# EasyEDA schematic SCH_QuestDeck_2025-08-01.json
TITLE: Sheet_1; REV: 1.0; Date: 2025-04-13; Sheet: 1/1; Drawn By: esemv; Company: Your Company
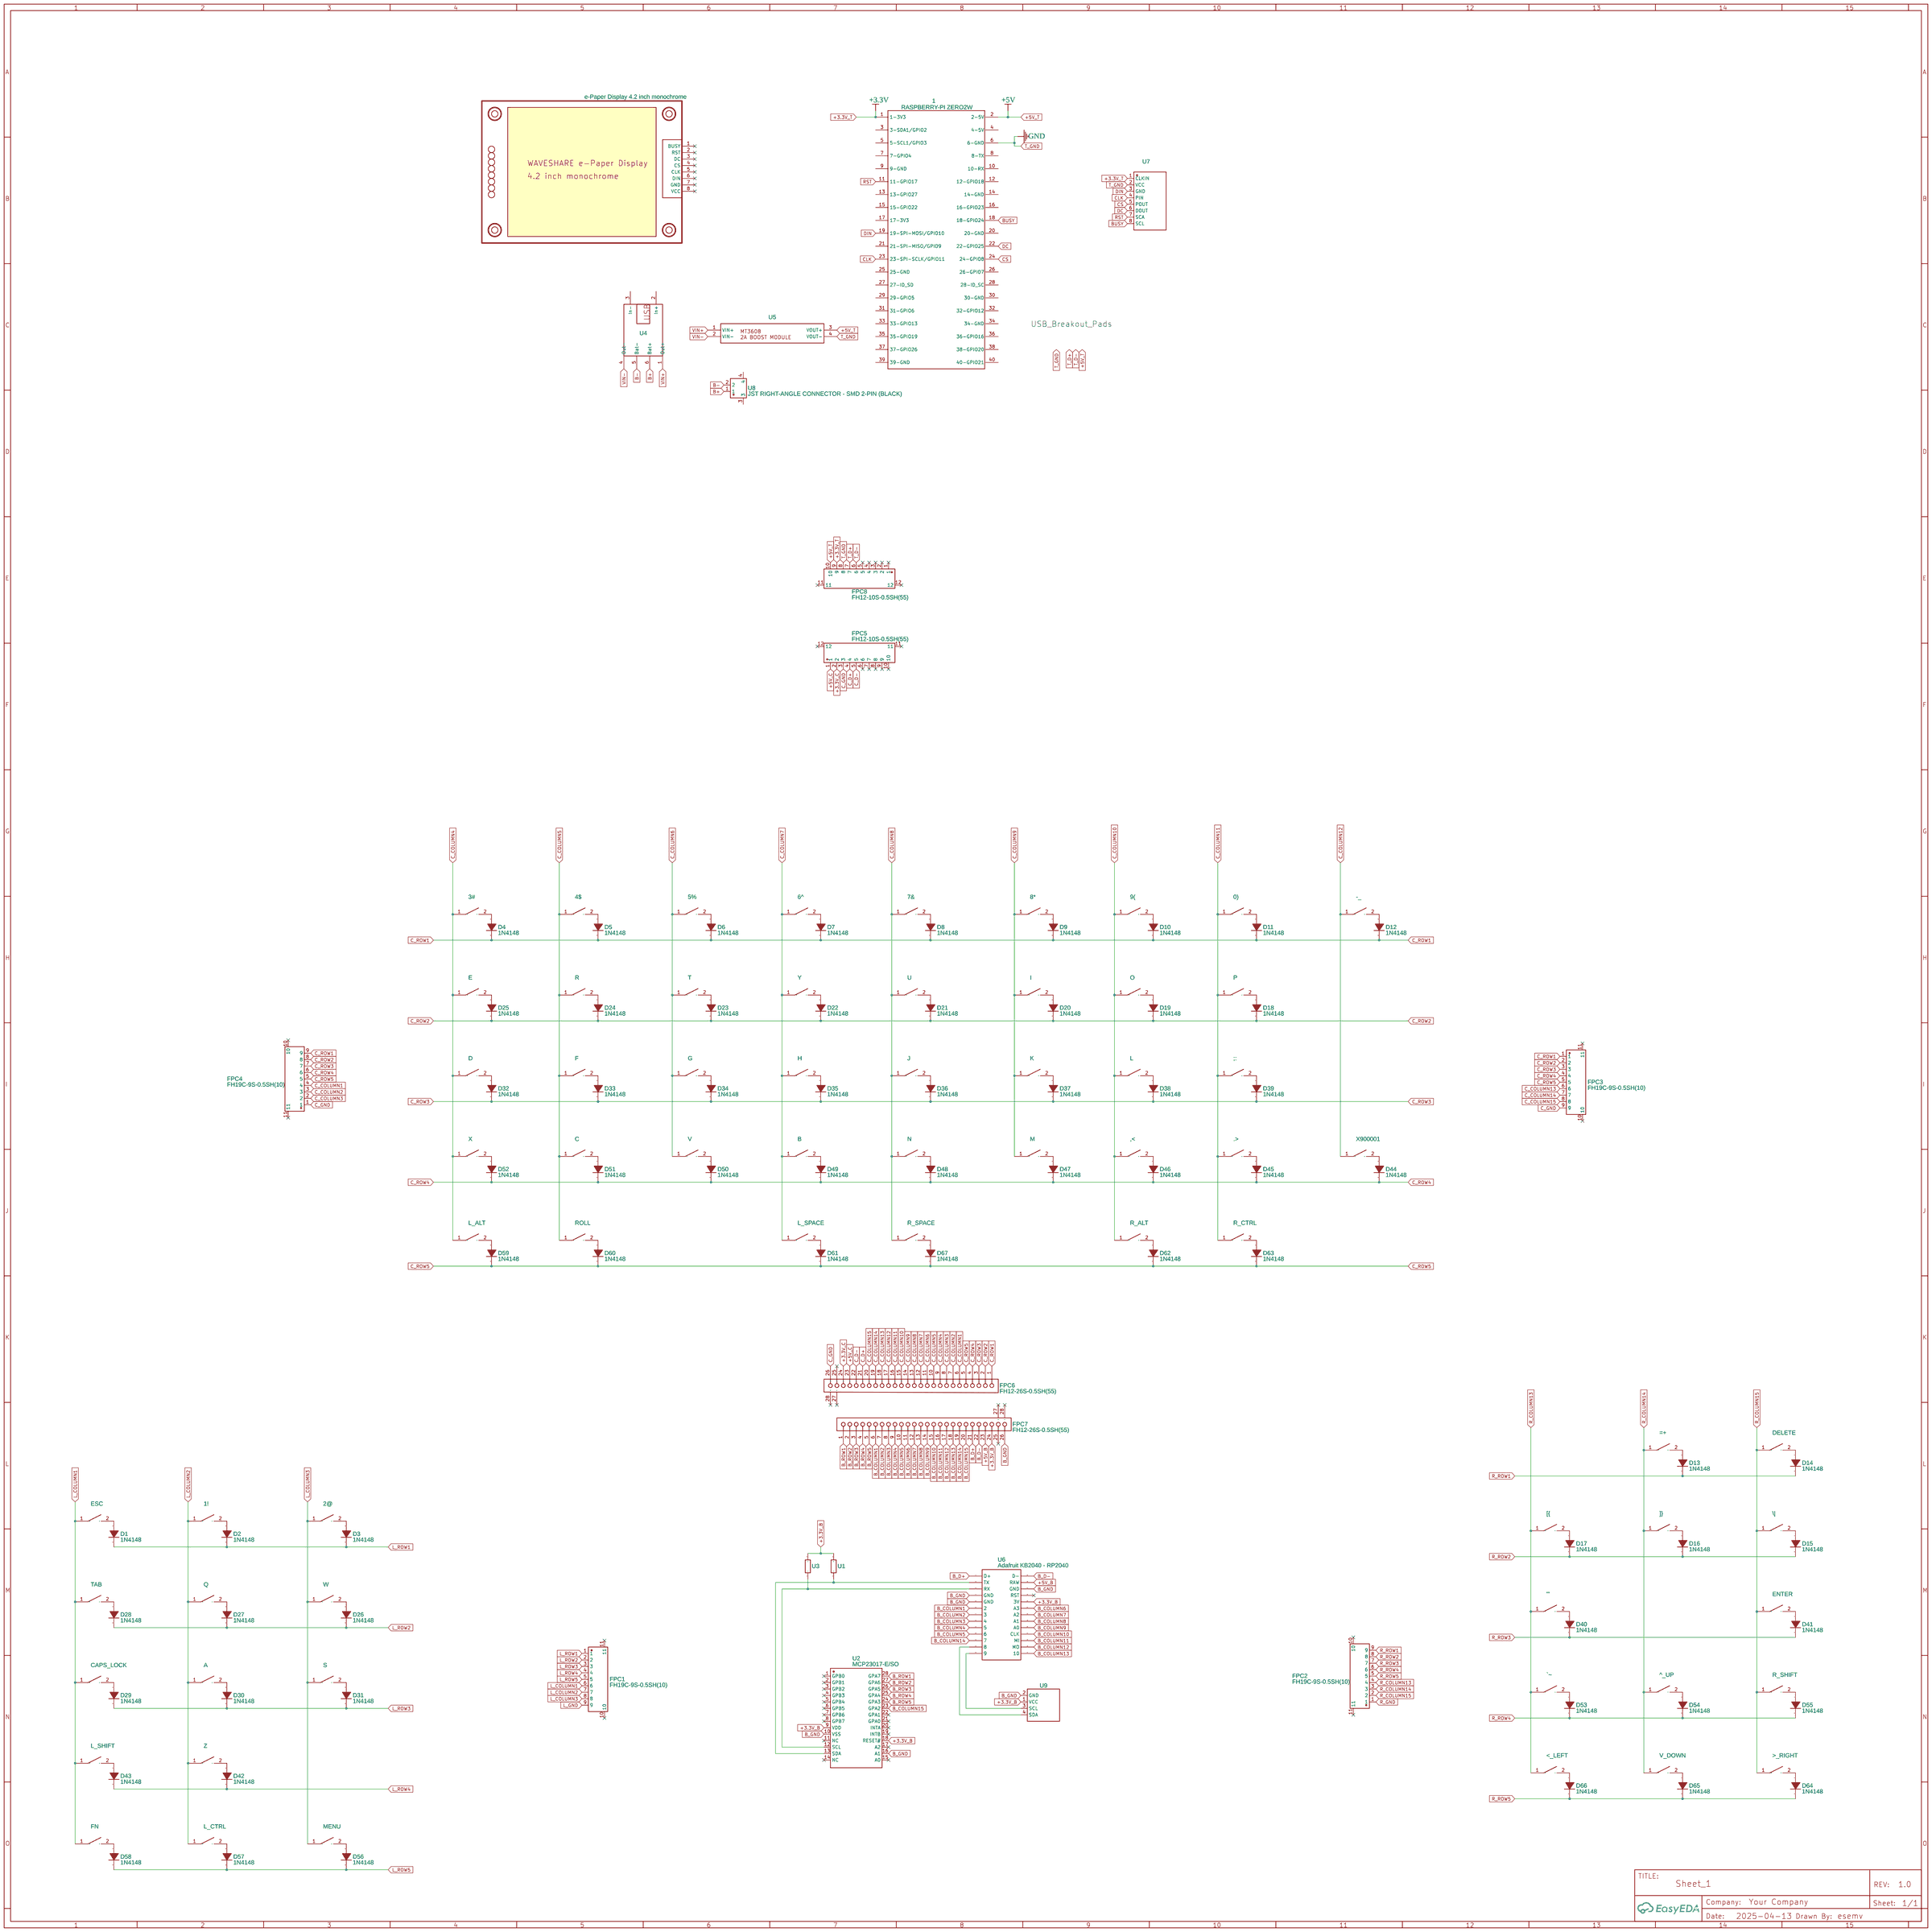
[diagram p0: schematic sheet]

## Parts
0)  NO  [KAILH-SWITCH]
1  RASPBERRY-PI ZERO2W  [RASPBERRY_PI_ZERO_SMD]
1!  NO  [KAILH-SWITCH]
2@  NO  [KAILH-SWITCH]
3#  NO  [KAILH-SWITCH]
4$  NO  [KAILH-SWITCH]
5%  NO  [KAILH-SWITCH]
6&#94;  NO  [KAILH-SWITCH]
6^  NO
7&  NO  [KAILH-SWITCH]
8*  NO  [KAILH-SWITCH]
9(  NO  [KAILH-SWITCH]
&#94;_UP  NO  [KAILH-SWITCH]
&#96;&#126;  NO  [KAILH-SWITCH]
'"  NO  [KAILH-SWITCH]
,<  NO  [KAILH-SWITCH]
-_  NO  [KAILH-SWITCH]
.>  NO  [KAILH-SWITCH]
/?#1  NO
;:  NO  [KAILH-SWITCH]
<_LEFT  NO  [KAILH-SWITCH]
=+  NO  [KAILH-SWITCH]
>_RIGHT  NO  [KAILH-SWITCH]
[{  NO  [KAILH-SWITCH]
\|  NO  [KAILH-SWITCH]
]}  NO  [KAILH-SWITCH]
^_UP  NO
`~  NO
A  NO  [KAILH-SWITCH]
B  NO  [KAILH-SWITCH]
C  NO  [KAILH-SWITCH]
CAPS_LOCK  NO  [KAILH-SWITCH]
D  NO  [KAILH-SWITCH]
D1  1N4148  [DO-35_BD2.0-L4.0-P8.00-D0.5-FD]
D2  1N4148  [DO-35_BD2.0-L4.0-P8.00-D0.5-FD]
D3  1N4148  [DO-35_BD2.0-L4.0-P8.00-D0.5-FD]
D4  1N4148  [DO-35_BD2.0-L4.0-P8.00-D0.5-FD]
D5  1N4148  [DO-35_BD2.0-L4.0-P8.00-D0.5-FD]
D6  1N4148  [DO-35_BD2.0-L4.0-P8.00-D0.5-FD]
D7  1N4148  [DO-35_BD2.0-L4.0-P8.00-D0.5-FD]
D8  1N4148  [DO-35_BD2.0-L4.0-P8.00-D0.5-FD]
D9  1N4148  [DO-35_BD2.0-L4.0-P8.00-D0.5-FD]
D10  1N4148  [DO-35_BD2.0-L4.0-P8.00-D0.5-FD]
D11  1N4148  [DO-35_BD2.0-L4.0-P8.00-D0.5-FD]
D12  1N4148  [DO-35_BD2.0-L4.0-P8.00-D0.5-FD]
D13  1N4148  [DO-35_BD2.0-L4.0-P8.00-D0.5-FD]
D14  1N4148  [DO-35_BD2.0-L4.0-P8.00-D0.5-FD]
D15  1N4148  [DO-35_BD2.0-L4.0-P8.00-D0.5-FD]
D16  1N4148  [DO-35_BD2.0-L4.0-P8.00-D0.5-FD]
D17  1N4148  [DO-35_BD2.0-L4.0-P8.00-D0.5-FD]
D18  1N4148  [DO-35_BD2.0-L4.0-P8.00-D0.5-FD]
D19  1N4148  [DO-35_BD2.0-L4.0-P8.00-D0.5-FD]
D20  1N4148  [DO-35_BD2.0-L4.0-P8.00-D0.5-FD]
D21  1N4148  [DO-35_BD2.0-L4.0-P8.00-D0.5-FD]
D22  1N4148  [DO-35_BD2.0-L4.0-P8.00-D0.5-FD]
D23  1N4148  [DO-35_BD2.0-L4.0-P8.00-D0.5-FD]
D24  1N4148  [DO-35_BD2.0-L4.0-P8.00-D0.5-FD]
D25  1N4148  [DO-35_BD2.0-L4.0-P8.00-D0.5-FD]
D26  1N4148  [DO-35_BD2.0-L4.0-P8.00-D0.5-FD]
D27  1N4148  [DO-35_BD2.0-L4.0-P8.00-D0.5-FD]
D28  1N4148  [DO-35_BD2.0-L4.0-P8.00-D0.5-FD]
D29  1N4148  [DO-35_BD2.0-L4.0-P8.00-D0.5-FD]
D30  1N4148  [DO-35_BD2.0-L4.0-P8.00-D0.5-FD]
D31  1N4148  [DO-35_BD2.0-L4.0-P8.00-D0.5-FD]
D32  1N4148  [DO-35_BD2.0-L4.0-P8.00-D0.5-FD]
D33  1N4148  [DO-35_BD2.0-L4.0-P8.00-D0.5-FD]
D34  1N4148  [DO-35_BD2.0-L4.0-P8.00-D0.5-FD]
D35  1N4148  [DO-35_BD2.0-L4.0-P8.00-D0.5-FD]
D36  1N4148  [DO-35_BD2.0-L4.0-P8.00-D0.5-FD]
D37  1N4148  [DO-35_BD2.0-L4.0-P8.00-D0.5-FD]
D38  1N4148  [DO-35_BD2.0-L4.0-P8.00-D0.5-FD]
D39  1N4148  [DO-35_BD2.0-L4.0-P8.00-D0.5-FD]
D40  1N4148  [DO-35_BD2.0-L4.0-P8.00-D0.5-FD]
D41  1N4148  [DO-35_BD2.0-L4.0-P8.00-D0.5-FD]
D42  1N4148  [DO-35_BD2.0-L4.0-P8.00-D0.5-FD]
D43  1N4148  [DO-35_BD2.0-L4.0-P8.00-D0.5-FD]
D44  1N4148  [DO-35_BD2.0-L4.0-P8.00-D0.5-FD]
D45  1N4148  [DO-35_BD2.0-L4.0-P8.00-D0.5-FD]
D46  1N4148  [DO-35_BD2.0-L4.0-P8.00-D0.5-FD]
D47  1N4148  [DO-35_BD2.0-L4.0-P8.00-D0.5-FD]
D48  1N4148  [DO-35_BD2.0-L4.0-P8.00-D0.5-FD]
D49  1N4148  [DO-35_BD2.0-L4.0-P8.00-D0.5-FD]
D50  1N4148  [DO-35_BD2.0-L4.0-P8.00-D0.5-FD]
D51  1N4148  [DO-35_BD2.0-L4.0-P8.00-D0.5-FD]
D52  1N4148  [DO-35_BD2.0-L4.0-P8.00-D0.5-FD]
D53  1N4148  [DO-35_BD2.0-L4.0-P8.00-D0.5-FD]
D54  1N4148  [DO-35_BD2.0-L4.0-P8.00-D0.5-FD]
D55  1N4148  [DO-35_BD2.0-L4.0-P8.00-D0.5-FD]
D56  1N4148  [DO-35_BD2.0-L4.0-P8.00-D0.5-FD]
D57  1N4148  [DO-35_BD2.0-L4.0-P8.00-D0.5-FD]
D58  1N4148  [DO-35_BD2.0-L4.0-P8.00-D0.5-FD]
D59  1N4148  [DO-35_BD2.0-L4.0-P8.00-D0.5-FD]
D60  1N4148  [DO-35_BD2.0-L4.0-P8.00-D0.5-FD]
D61  1N4148  [DO-35_BD2.0-L4.0-P8.00-D0.5-FD]
D62  1N4148  [DO-35_BD2.0-L4.0-P8.00-D0.5-FD]
D63  1N4148  [DO-35_BD2.0-L4.0-P8.00-D0.5-FD]
D64  1N4148  [DO-35_BD2.0-L4.0-P8.00-D0.5-FD]
D65  1N4148  [DO-35_BD2.0-L4.0-P8.00-D0.5-FD]
D66  1N4148  [DO-35_BD2.0-L4.0-P8.00-D0.5-FD]
D67  1N4148  [DO-35_BD2.0-L4.0-P8.00-D0.5-FD]
DELETE  NO  [KAILH-SWITCH]
E  NO  [KAILH-SWITCH]
ENTER  NO  [KAILH-SWITCH]
ESC  NO  [KAILH-SWITCH]
F  NO  [KAILH-SWITCH]
FN  NO  [KAILH-SWITCH]
FPC1  FH19C-9S-0.5SH(10)  [FPC-SMD_9P-P0.50_FH19C-9S-0.5SH-10]
FPC2  FH19C-9S-0.5SH(10)  [FPC-SMD_9P-P0.50_FH19C-9S-0.5SH-10]
FPC3  FH19C-9S-0.5SH(10)  [FPC-SMD_9P-P0.50_FH19C-9S-0.5SH-10]
FPC4  FH19C-9S-0.5SH(10)  [FPC-SMD_9P-P0.50_FH19C-9S-0.5SH-10]
FPC5  FH12-10S-0.5SH(55)  [FPC-SMD_FH12-10S-0.5SH-55]
FPC6  FH12-26S-0.5SH(55)  [FPC-SMD_FH12-26S-0.5SH-55]
FPC7  FH12-26S-0.5SH(55)  [FPC-SMD_FH12-26S-0.5SH-55]
FPC8  FH12-10S-0.5SH(55)  [FPC-SMD_FH12-10S-0.5SH-55]
G  NO  [KAILH-SWITCH]
H  NO  [KAILH-SWITCH]
I  NO  [KAILH-SWITCH]
J  NO  [KAILH-SWITCH]
K  NO  [KAILH-SWITCH]
L  NO  [KAILH-SWITCH]
L_ALT  NO  [SW_KAILH_CHOC_V1_1.25U]
L_CTRL  NO  [KAILH-SWITCH]
L_SHIFT  NO  [KAILH-SWITCH]
L_SPACE  NO  [KAILH-SWITCH]
M  NO  [KAILH-SWITCH]
MENU  NO  [KAILH-SWITCH]
N  NO  [KAILH-SWITCH]
NO  e-Paper Display 4.2 inch monochrome  [EPAPER DISPLAY 4.2INCH WAVESHARE]
O  NO  [KAILH-SWITCH]
P  NO  [KAILH-SWITCH]
Q  NO  [KAILH-SWITCH]
R  NO  [KAILH-SWITCH]
R_ALT  NO  [KAILH-SWITCH]
R_CTRL  NO  [SW_KAILH_CHOC_V1_1.25U]
R_SHIFT  NO  [KAILH-SWITCH]
R_SPACE  NO  [KAILH-SWITCH]
ROLL  NO  [KAILH-SWITCH]
S  NO  [KAILH-SWITCH]
T  NO  [KAILH-SWITCH]
TAB  NO  [KAILH-SWITCH]
U  NO  [KAILH-SWITCH]
U1  NO  [AXIAL-0.4]
U2  MCP23017-E/SO  [SOIC-28_L18.0-W7.5-P1.27-LS10.3-BL]
U3  NO  [AXIAL-0.4]
U4  NO  [TP4056_SMD]
U5  NO  [MT3608]
U6  Adafruit KB2040 - RP2040  [ADAFRUIT KB2040 - RP2040]
U7  NO  [8 PIN]
U8  JST RIGHT-ANGLE CONNECTOR - SMD 2-PIN (BLACK)  [CONN-SMD_JST-PH-2-SMT-RA]
U9  NO  [OLED DISPLAY 128X32 0.91" I2C SSD1306]
V  NO  [KAILH-SWITCH]
V_DOWN  NO  [KAILH-SWITCH]
W  NO  [KAILH-SWITCH]
X  NO  [KAILH-SWITCH]
Y  NO  [KAILH-SWITCH]
Z  NO  [KAILH-SWITCH]

## Library data of the parts
0) 1! 2@ 3# 4$ 5% 6&#94; 7& 8* 9( &#94;_UP &#96;&#126; '" ,< -_ .> ;: <_LEFT =+ >_RIGHT [{ \| ]} A B C CAPS_LOCK D DELETE E ENTER ESC F FN G H I J K L L_ALT L_CTRL L_SHIFT L_SPACE M MENU N O P Q R R_ALT R_CTRL R_SHIFT R_SPACE ROLL S T TAB U V V_DOWN W X Y Z = kailh choc switch v1: Contributor: bplusplus
1 = RASPBERRY-PI ZERO2W: Contributor: Felipe Andrés Almeyda
6^ = kailh choc switch v1_6
/?#1 = kailh choc switch v1_43
^_UP = kailh choc switch v1_53
`~ = kailh choc switch v1_52
D1-D67 = 1N4148: Supplier: LCSC; Manufacturer: ST(先科); Supplier Part: C14516; JLCPCB Part Class: Extended Part; link: https://lcsc.com/eda_search?q=C14516&%26type=1&ref=editor
FPC1-FPC4 = FH19C-9S-0.5SH(10): Contributor: LCSC; Supplier: LCSC; Supplier Part: C598007; Manufacturer: HRS(广濑); JLCPCB Part Class: Extended Part; link: https://lcsc.com/eda_search?q=C598007&%26type=1&ref=editor
FPC5 FPC8 = FH12-10S-0.5SH(55): Contributor: LCSC; Supplier: LCSC; Supplier Part: C506791; Manufacturer: HRS(广濑); JLCPCB Part Class: Extended Part; link: https://lcsc.com/eda_search?q=C506791&%26type=1&ref=editor
FPC6 FPC7 = FH12-26S-0.5SH(55): Contributor: LCSC; Supplier: LCSC; Supplier Part: C202113; Manufacturer: HRS(广濑); JLCPCB Part Class: Extended Part; link: https://lcsc.com/eda_search?q=C202113&%26type=1&ref=editor
NO = e-Paper Display 4.2 inch monochrome: Manufacturer: Waveshare; Supplier: Waveshare; Supplier Part: 4.2inch e-Paper Module; link: https://www.waveshare.com/product/displays/e-paper/epaper-2/4.2inch-e-paper-module.htm; Contributor: Guest; Datasheet: http://www.waveshare.com/wiki/4.2inch_e-Paper_Module
U1 U3 = 4.7KΩ: Power: 1/4W; Tolerance: ±1%; Supplier Part: C57204; Supplier: LCSC; Manufacturer: UniOhm; Manufacturer Part: MFR0W4F4701A50
U2 = MCP23017-E/SO: Contributor: LCSC; Supplier: LCSC; Manufacturer: MICROCHIP(美国微芯); Supplier Part: C47023; JLCPCB Part Class: Extended Part; link: https://lcsc.com/eda_search?q=C47023&%26type=1&ref=editor
U4 = TP4056: Manufacturer Part: CHB-C-LIT1A; Supplier: Berrybase; Supplier Part: CHB-C-LIT1A; Contributor: mverch
U5 = MT3608: Contributor: witchayut109
U6 = Adafruit KB2040 - RP2040: Contributor: rqpenegor
U7 = CABLE_END_8_PIN: Contributor: xander0_
U8 = JST RIGHT-ANGLE CONNECTOR - SMD 2-PIN (BLACK): Supplier: LCSC; Supplier Part: C9900141337; Manufacturer: null; Manufacturer Part: JST Right-Angle Connector - SMD 2-Pin (Black); JLCPCB Part Class: Extended Part; Contributor: lcsc; link: https://lcsc.com/eda_search?q=C9900141337&%26type=1&ref=editor
U9 = JM SSD1306-128X32-OLED-0.91: sourceId: wICUcuL3l

## Nets
+3.3V_B: FPC7.24 U1.2 U2.9(VDD) U2.18(RESET#) U3.2 U6.22(3V) U9.1(VCC)
+3.3V_C: FPC5.2 FPC6.24
+3.3V_T: 1.1(1-3V3) FPC8.9 U7.1(CLKIN)
+5V_B: FPC7.23 U6.25(RAW)
+5V_C: FPC5.1 FPC6.23
+5V_T: 1.2(2-5V) FPC8.10 U5.3(VOUT+)
VIN+: U4.1(Out+) U5.1(VIN+)
VIN-: U4.4(Out-) U5.2(VIN-)
B+: U4.6(Bat+) U8.1
B-: U4.5(Bat-) U8.2
B_COLUMN1: FPC7.6 U6.6(2)
B_COLUMN2: FPC7.7 U6.7(3)
B_COLUMN3: FPC7.8 U6.8(4)
B_COLUMN4: FPC7.9 U6.9(5)
B_COLUMN5: FPC7.10 U6.10(6)
B_COLUMN6: FPC7.11 U6.21(A3)
B_COLUMN7: FPC7.12 U6.20(A2)
B_COLUMN8: FPC7.13 U6.19(A1)
B_COLUMN9: FPC7.14 U6.18(A0)
B_COLUMN10: FPC7.15 U6.17(CLK)
B_COLUMN11: FPC7.16 U6.16(MI)
B_COLUMN12: FPC7.17 U6.15(MO)
B_COLUMN13: FPC7.18 U6.14(10)
B_COLUMN14: FPC7.19 U6.11(7)
B_COLUMN15: FPC7.20 U2.23(GPA2)
B_D+: FPC7.21 U6.1(D+)
B_D-: FPC7.22 U6.26(D-)
B_GND: FPC7.26 U2.10(VSS) U2.16(A1) U6.4(GND) U6.5(GND) U6.24(GND) U9.2(GND)
B_ROW1: FPC7.1 U2.28(GPA7)
B_ROW2: FPC7.2 U2.27(GPA6)
B_ROW3: FPC7.3 U2.26(GPA5)
B_ROW4: FPC7.4 U2.25(GPA4)
B_ROW5: FPC7.5 U2.24(GPA3)
BUSY: 1.18(18-GPIO24) U7.8(SCL)
C_COLUMN1: FPC4.4 FPC6.6
C_COLUMN2: FPC4.3 FPC6.7
C_COLUMN3: FPC4.2 FPC6.8
C_COLUMN4: 3#.1(TOP) D.1(TOP) E.1(TOP) FPC6.9 L_ALT.1(TOP) X.1(TOP)
C_COLUMN5: 4$.1(TOP) C.1(TOP) F.1(TOP) FPC6.10 R.1(TOP) ROLL.1(TOP)
C_COLUMN6: 5%.1(TOP) FPC6.11 G.1(TOP) T.1(TOP) V.1(TOP)
C_COLUMN7: 6^.1(TOP) B.1(TOP) FPC6.12 H.1(TOP) L_SPACE.1(TOP) Y.1(TOP)
C_COLUMN8: 7&.1(TOP) FPC6.13 J.1(TOP) N.1(TOP) R_SPACE.1(TOP) U.1(TOP)
C_COLUMN9: 8*.1(TOP) FPC6.14 I.1(TOP) K.1(TOP) M.1(TOP)
C_COLUMN10: 9(.1(TOP) ,<.1(TOP) FPC6.15 L.1(TOP) O.1(TOP) R_ALT.1(TOP)
C_COLUMN11: 0).1(TOP) .>.1(TOP) ;:.1(TOP) FPC6.16 P.1(TOP) R_CTRL.1(TOP)
C_COLUMN12: -_.1(TOP) /?#1.1(TOP) FPC6.17
C_COLUMN13: FPC3.6 FPC6.18
C_COLUMN14: FPC3.7 FPC6.19
C_COLUMN15: FPC3.8 FPC6.20
C_D+: FPC5.4 FPC6.21
C_D-: FPC5.5 FPC6.22
C_GND: FPC3.9 FPC4.1 FPC5.3 FPC6.26
C_ROW1: D4.2(C) D5.2(C) D6.2(C) D7.2(C) D8.2(C) D9.2(C) D10.2(C) D11.2(C) D12.2(C) FPC3.1 FPC4.9 FPC6.1
C_ROW2: D18.2(C) D19.2(C) D20.2(C) D21.2(C) D22.2(C) D23.2(C) D24.2(C) D25.2(C) FPC3.2 FPC4.8 FPC6.2
C_ROW3: D32.2(C) D33.2(C) D34.2(C) D35.2(C) D36.2(C) D37.2(C) D38.2(C) D39.2(C) FPC3.3 FPC4.7 FPC6.3
C_ROW4: D44.2(C) D45.2(C) D46.2(C) D47.2(C) D48.2(C) D49.2(C) D50.2(C) D51.2(C) D52.2(C) FPC3.4 FPC4.6 FPC6.4
C_ROW5: D59.2(C) D60.2(C) D61.2(C) D62.2(C) D63.2(C) D67.2(C) FPC3.5 FPC4.5 FPC6.5
CLK: 1.23(23-SPI-SCLK/GPIO11) U7.4(PIN)
CS: 1.24(24-GPIO8) U7.5(POUT)
DC: 1.22(22-GPIO25) U7.6(DOUT)
DIN: 1.19(19-SPI-MOSI/GPIO10) U7.3(GND)
L_COLUMN1: CAPS_LOCK.1(TOP) ESC.1(TOP) FN.1(TOP) FPC1.6 L_SHIFT.1(TOP) TAB.1(TOP)
L_COLUMN2: 1!.1(TOP) A.1(TOP) FPC1.7 L_CTRL.1(TOP) Q.1(TOP) Z.1(TOP)
L_COLUMN3: 2@.1(TOP) FPC1.8 MENU.1(TOP) S.1(TOP) W.1(TOP)
L_GND: FPC1.9
L_ROW1: D1.2(C) D2.2(C) D3.2(C) FPC1.1
L_ROW2: D26.2(C) D27.2(C) D28.2(C) FPC1.2
L_ROW3: D29.2(C) D30.2(C) D31.2(C) FPC1.3
L_ROW4: D42.2(C) D43.2(C) FPC1.4
L_ROW5: D56.2(C) D57.2(C) D58.2(C) FPC1.5
R_COLUMN13: '".1(TOP) <_LEFT.1(TOP) [{.1(TOP) `~.1(TOP) FPC2.4
R_COLUMN14: =+.1(TOP) ]}.1(TOP) ^_UP.1(TOP) FPC2.3 V_DOWN.1(TOP)
R_COLUMN15: >_RIGHT.1(TOP) \|.1(TOP) DELETE.1(TOP) ENTER.1(TOP) FPC2.2 R_SHIFT.1(TOP)
R_GND: FPC2.1
R_ROW1: D13.2(C) D14.2(C) FPC2.9
R_ROW2: D15.2(C) D16.2(C) D17.2(C) FPC2.8
R_ROW3: D40.2(C) D41.2(C) FPC2.7
R_ROW4: D53.2(C) D54.2(C) D55.2(C) FPC2.6
R_ROW5: D64.2(C) D65.2(C) D66.2(C) FPC2.5
RST: 1.11(11-GPIO17) U7.7(SCA)
T_D+: FPC8.7
T_D-: FPC8.6
T_GND: 1.6(6-GND) FPC8.8 U5.4(VOUT-) U7.2(VCC)
Net-(0)-RI): 0).2(RI) D11.1(A)
Net-(1!-RI): 1!.2(RI) D2.1(A)
Net-(2@-RI): 2@.2(RI) D3.1(A)
Net-(3#-RI): 3#.2(RI) D4.1(A)
Net-(4$-RI): 4$.2(RI) D5.1(A)
Net-(5%-RI): 5%.2(RI) D6.1(A)
Net-(6^-RI): 6^.2(RI) D7.1(A)
Net-(7&-RI): 7&.2(RI) D8.1(A)
Net-(8*-RI): 8*.2(RI) D9.1(A)
Net-(9(-RI): 9(.2(RI) D10.1(A)
Net-('"-RI): '".2(RI) D40.1(A)
Net-(,<-RI): ,<.2(RI) D46.1(A)
Net-(-_-RI): -_.2(RI) D12.1(A)
Net-(.>-RI): .>.2(RI) D45.1(A)
Net-(;:-RI): ;:.2(RI) D39.1(A)
Net-(<_LEFT-RI): <_LEFT.2(RI) D66.1(A)
Net-(=+-RI): =+.2(RI) D13.1(A)
Net-(>_RIGHT-RI): >_RIGHT.2(RI) D64.1(A)
Net-(A-RI): A.2(RI) D30.1(A)
Net-(B-RI): B.2(RI) D49.1(A)
Net-(C-RI): C.2(RI) D51.1(A)
Net-(CAPS_LOCK-RI): CAPS_LOCK.2(RI) D29.1(A)
Net-(D1-A): D1.1(A) ESC.2(RI)
Net-(D14-A): D14.1(A) DELETE.2(RI)
Net-(D15-A): \|.2(RI) D15.1(A)
Net-(D16-A): ]}.2(RI) D16.1(A)
Net-(D17-A): [{.2(RI) D17.1(A)
Net-(D18-A): D18.1(A) P.2(RI)
Net-(D19-A): D19.1(A) O.2(RI)
Net-(D20-A): D20.1(A) I.2(RI)
Net-(D21-A): D21.1(A) U.2(RI)
Net-(D22-A): D22.1(A) Y.2(RI)
Net-(D23-A): D23.1(A) T.2(RI)
Net-(D24-A): D24.1(A) R.2(RI)
Net-(D25-A): D25.1(A) E.2(RI)
Net-(D26-A): D26.1(A) W.2(RI)
Net-(D27-A): D27.1(A) Q.2(RI)
Net-(D28-A): D28.1(A) TAB.2(RI)
Net-(D31-A): D31.1(A) S.2(RI)
Net-(D33-A): D33.1(A) F.2(RI)
Net-(D34-A): D34.1(A) G.2(RI)
Net-(D35-A): D35.1(A) H.2(RI)
Net-(D36-A): D36.1(A) J.2(RI)
Net-(D37-A): D37.1(A) K.2(RI)
Net-(D38-A): D38.1(A) L.2(RI)
Net-(D41-A): D41.1(A) ENTER.2(RI)
Net-(D42-A): D42.1(A) Z.2(RI)
Net-(D43-A): D43.1(A) L_SHIFT.2(RI)
Net-(D44-A): /?#1.2(RI) D44.1(A)
Net-(D47-A): D47.1(A) M.2(RI)
Net-(D48-A): D48.1(A) N.2(RI)
Net-(D50-A): D50.1(A) V.2(RI)
Net-(D52-A): D52.1(A) X.2(RI)
Net-(D53-A): `~.2(RI) D53.1(A)
Net-(D54-A): ^_UP.2(RI) D54.1(A)
Net-(D55-A): D55.1(A) R_SHIFT.2(RI)
Net-(D56-A): D56.1(A) MENU.2(RI)
Net-(D57-A): D57.1(A) L_CTRL.2(RI)
Net-(D58-A): D58.1(A) FN.2(RI)
Net-(D59-A): D59.1(A) L_ALT.2(RI)
Net-(D60-A): D60.1(A) ROLL.2(RI)
Net-(D61-A): D61.1(A) L_SPACE.2(RI)
Net-(D62-A): D62.1(A) R_ALT.2(RI)
Net-(D63-A): D63.1(A) R_CTRL.2(RI)
Net-(D65-A): D65.1(A) V_DOWN.2(RI)
Net-(D67-A): D67.1(A) R_SPACE.2(RI)
Net-(D-RI): D.2(RI) D32.1(A)
Net-(U2-SCL): U2.12(SCL) U3.1 U6.3(RX)
Net-(U2-SDA): U1.1 U2.13(SDA) U6.2(TX)
Net-(U6-8): U6.12(8) U9.4(SDA)
Net-(U6-9): U6.13(9) U9.3(SCL)

Not connected (* = marked no-connect by the designer): 1 3(3-SDA1/GPIO2) 4(4-5V) 5(5-SCL1/GPIO3) 7(7-GPIO4) 8(8-TX) 9(9-GND) 10(10-RX) 12(12-GPIO18) 13(13-GPIO27) 14(14-GND) 15(15-GPIO22) 16(16-GPIO23) 17(17-3V3) 20(20-GND) 21(21-SPI-MISO/GPIO9) 25(25-GND) 26(26-GPIO7) 27(27-ID_SD) 28(28-ID_SC) 29(29-GPIO5) 30(30-GND) 31(31-GPIO6) 32(32-GPIO12) 33(33-GPIO13) 34(34-GND) 35(35-GPIO19) 36(36-GPIO16) 37(37-GPIO26) 38(38-GPIO20) 39(39-GND) 40(40-GPIO21); FPC1 10* 11*; FPC2 10* 11*; FPC3 10* 11*; FPC4 10* 11*; FPC5 6* 7* 8* 9* 10* 11* 12*; FPC6 25* 27* 28*; FPC7 25* 27* 28*; FPC8 1* 2* 3* 4* 5* 11* 12*; NO 1(BUSY)* 2(RST)* 3(DC)* 4(CS)* 5(CLK)* 6(DIN)* 7(GND)* 8(VCC)*; U2 1(GPB0)* 2(GPB1)* 3(GPB2)* 4(GPB3)* 5(GPB4)* 6(GPB5)* 7(GPB6)* 8(GPB7)* 11(NC)* 14(NC)* 15(A0)* 17(A2)* 19(INTB)* 20(INTA)* 21(GPA0)* 22(GPA1)*; U4 2(In+) 3(In-); U6 23(RST)*; U8 3 4

## Notes on the sheet
- USB_Breakout_Pads
